# Altium project Ground_plate.PrjPcb
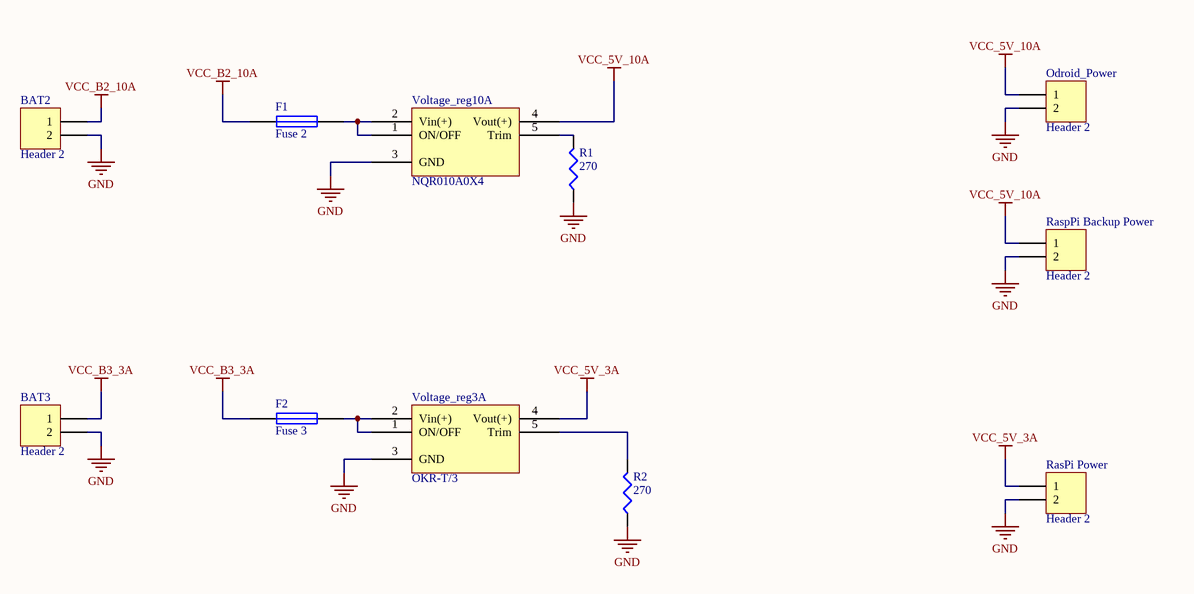
[diagram p0: DCDC_converters.SchDoc]
4 sheets, 41 parts. Net scope: global (net labels, ports and power ports of the same name join across sheets).
Board file: Ground_plate.PcbDoc
Sheets:
  DCDC_converters.SchDoc
  IMU_level_shifter.SchDoc
  Motor_driver.SchDoc
  wheelmotor_connections.SchDoc

## Sheet DCDC_converters.SchDoc
size A4; Organization: EPFL; DocumentNumber: 1; Revision: 1; SheetNumber: 1; SheetTotal: 1

### Parts
BAT2  Header 2  [STL1550/2-3.5]
BAT3  Header 2  [STL1550/2-3.5]
F1  Fuse 2  [FUSE_22.5MM]
F2  Fuse 3  [FUSE_22.5MM]
Odroid_Power  Header 2  [STL1550/2-3.5]
R1  270  [0805_G]
R2  270  [0805_G]
RasPi_Power  Header 2  [STL1550/2-3.5]
RaspPi_Backup_Power  Header 2  [STL1550/2-3.5]
Voltage_reg3A  OKR-T/3  [DC_Converter_3A]
Voltage_reg10A  NQR010A0X4  [DC_Converter_10A]

### Nets
GND: BAT2.2 BAT3.2 Odroid_Power.2 R1.1 R2.1 RasPi_Power.2 RaspPi_Backup_Power.2 Voltage_reg3A.3(GND) Voltage_reg10A.3(GND)
VCC_5V_3A: RasPi_Power.1 Voltage_reg3A.4(Vout(+))
VCC_5V_10A: Odroid_Power.1 RaspPi_Backup_Power.1 Voltage_reg10A.4(Vout(+))
VCC_B2_10A: BAT2.1 F1.1
VCC_B3_3A: BAT3.1 F2.1
NetF1_2: F1.2 Voltage_reg10A.1(ON/OFF) Voltage_reg10A.2(Vin(+))
NetF2_2: F2.2 Voltage_reg3A.1(ON/OFF) Voltage_reg3A.2(Vin(+))
NetR1_2: R1.2 Voltage_reg10A.5(Trim)
NetR2_2: R2.2 Voltage_reg3A.5(Trim)

### Notes on the sheet
- Title
- Size:
- Date:
- A4
- Number:
- Time:
- Revision:
- Sheet
- of
- File:

### Library data of the parts
BAT2 BAT3 Odroid_Power RasPi_Power RaspPi_Backup_Power = Header 2: Header, 2-Pin; LatestRevisionDate: 17-Jul-2002; LatestRevisionNote: Re-released for DXP Platform.; Publisher: Altium Limited
F1 F2 = Fuse 1: Fuse; Published: 8-Jun-2000; LatestRevisionDate: 17-Jul-2002; LatestRevisionNote: Re-released for DXP Platform.; PackageReference: PIN-W2/E2.8; Publisher: Altium Limited; PackageDescription: Thru-Hole; 2 Leads
R1 R2 = Res3: Resistor; Value: 1K; Published: 8-Jun-2000; LatestRevisionDate: 29-May-2009; LatestRevisionNote: IPC-7351 Footprint Added.; PackageReference: J1-0603; Publisher: Altium Limited; PackageDescription: Chip Resistor
Voltage_reg3A = OKR-T/3: DCDC Converter 3Amps
Voltage_reg10A = NQR010A0X4: DCDC Converter 10Amps; Mfr: LINEAGE POWER

## Sheet IMU_level_shifter.SchDoc
size A4; PageSetup: Record=PageOptions|CenterHorizontal=True|CenterVertical=True|PrintScale=0.71|XCorrection=1.00|YCorrection=1.00|PrintKind=1|BorderSize=5000000|LeftOffset=0|BottomOffset=0|Orientation=2|PaperLength=1000|PaperWidth=1000|Scale=100|PaperSource=7|PrintQuality=-4|MediaType=1|DitherType=10|PaperKind=A3 (297 x 420 mm)|PrintScaleMode=1; Organization: EPFL; DocumentNumber: 1; Revision: 1; SheetNumber: 1; SheetTotal: 1
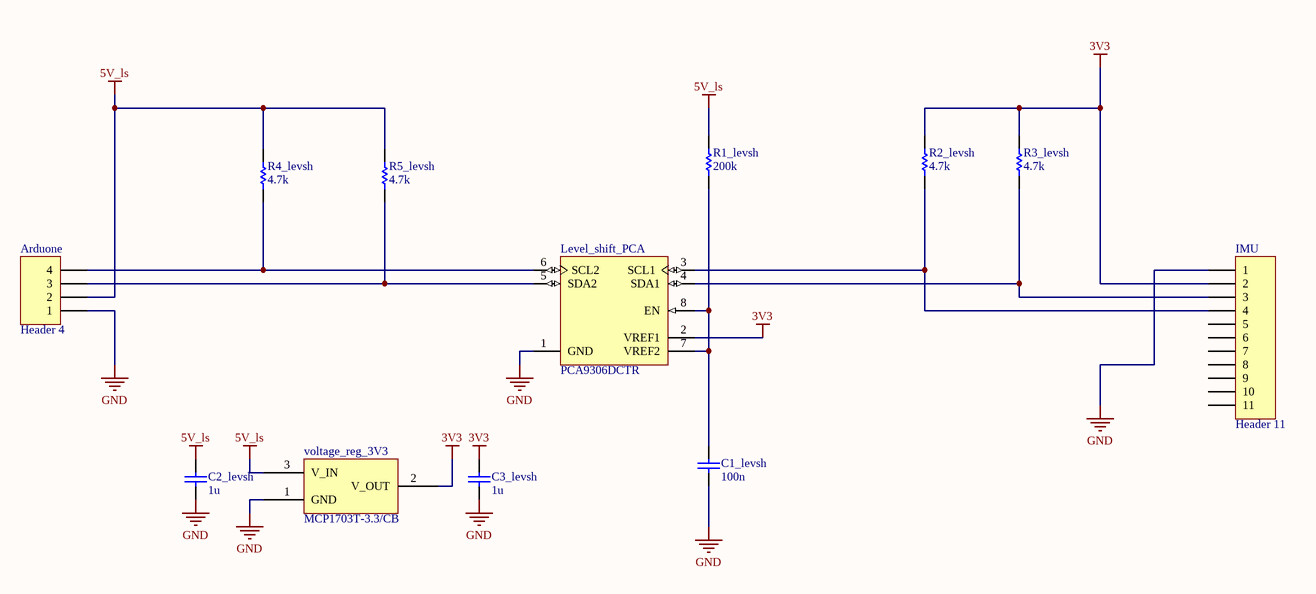
[diagram p1: IMU_level_shifter.SchDoc]

### Parts
Arduone  Header 4  [HDR1X4]
C1_levsh  100n  [CAPC1608N]
C2_levsh  1u  [CAPC1608N]
C3_levsh  1u  [CAPC1608N]
IMU  Header 11  [HDR1X11]
Level_shift_PCA  PCA9306DCTR  [DCT8_N]
R1_levsh  200k  [RESC1608N]
R2_levsh  4.7k  [RESC1608N]
R3_levsh  4.7k  [RESC1608N]
R4_levsh  4.7k  [RESC1608N]
R5_levsh  4.7k  [RESC1608N]
voltage_reg_3V3  MCP1703T-3.3/CB  [SOT23-3N]

### Nets
3V3: C3_levsh.2 IMU.2 Level_shift_PCA.2(VREF1) R2_levsh.2 R3_levsh.2 voltage_reg_3V3.2(V_OUT)
5V_ls: Arduone.2 C2_levsh.2 R1_levsh.1 R4_levsh.2 R5_levsh.2 voltage_reg_3V3.3(V_IN)
GND: Arduone.1 C1_levsh.1 C2_levsh.1 C3_levsh.1 IMU.1 Level_shift_PCA.1(GND) voltage_reg_3V3.1(GND)
NetArduone_3: Arduone.3 Level_shift_PCA.5(SDA2) R5_levsh.1
NetArduone_4: Arduone.4 Level_shift_PCA.6(SCL2) R4_levsh.1
NetC1_levsh_2: C1_levsh.2 Level_shift_PCA.7(VREF2) Level_shift_PCA.8(EN) R1_levsh.2
NetIMU_3: IMU.3 Level_shift_PCA.4(SDA1) R3_levsh.1
NetIMU_4: IMU.4 Level_shift_PCA.3(SCL1) R2_levsh.1

Not connected (* = marked no-connect by the designer): IMU 5 6 7 8 9 10 11

### Notes on the sheet
- Title
- Size:
- Date:
- A4
- Number:
- Time:
- Revision:
- Sheet
- of
- File:

### Library data of the parts
Arduone = Header 4: Header, 4-Pin; LatestRevisionDate: 17-Jul-2002; LatestRevisionNote: Re-released for DXP Platform.; Publisher: Altium Limited
C1_levsh C2_levsh C3_levsh = Cap: Capacitor; Published: 8-Jun-2000; LatestRevisionDate: 17-Jul-2002; LatestRevisionNote: Re-released for DXP Platform.; PackageReference: RAD-0.3; Publisher: Altium Limited; PackageDescription: Radial Cap, Thru-Hole; 2 Leads; 0.3 in Pin Spacing
IMU = Header 11: Header, 11-Pin; LatestRevisionDate: 17-Jul-2002; LatestRevisionNote: Re-released for DXP Platform.; Publisher: Altium Limited
Level_shift_PCA = PCA9306DCTR: Dual Bi-Directional I2C-Bus and SMBus Voltage Level-Translator, 0 to 5.5 V, -40 to 85 degC, 8-pin SM8 (DCT), Green (RoHS & no Sb/Br); Manufacturer: Texas Instruments; SubFamily: I2C Special Function; No. of Outputs: 2; tpd max(ns): 1.5; fSCLK(Max)(MHz): 400; Function: Voltage Translator; Vcc range(V): 0 to 5.5; Enable Pin: Yes; Rating: Catalog; DatasheetVersion: SCPS113J; PackageVersion: revC, Sep-2002; PackageReference: DCT8; PackageDescription: 8-Pin Thin Small Outline Package 3 x 2.8 mm Body ,0.65 mm Pitch; Supplier 1: Digi-Key; Supplier Part Number 1: 296-18509-2-ND; Supplier 2: Digi-Key; Supplier Part Number 2: 296-18509-1-ND; Supplier 3: Digi-Key; Supplier Part Number 3: 296-18509-6-ND; Supplier 4: Farnell; Supplier Part Number 4: 1470936RL; Supplier 5: Farnell; Supplier Part Number 5: 1470936; Supplier 6: Newark; Supplier Part Number 6: 65J6232; Supplier 7: Mouser; Supplier Part Number 7: 595-PCA9306DCTR; Eco-Plan: Green (RoHS & no Sb/Br); Max Frequency(kHz): 400; Open Drain I/O Type: Yes; 5V Tolerant I/O: Yes; On-Chip Power-on-Reset: No; Mounting Technology: Surface Mount; PartNumber: PCA9306DCTR; Code_JEDEC: MO-187-DA; ComponentLink1Description: Datasheet; ComponentLink1URL: http://www.ti.com/general/docs/lit/getliterature.tsp?genericPartNumber=PCA9306&fileType=pdf; ComponentLink2Description: Package Specification; ComponentLink2URL: http://www.ti.com/litv/pdf/mpds049b
R1_levsh R2_levsh R3_levsh R4_levsh R5_levsh = Res1: Resistor; Published: 8-Jun-2000; LatestRevisionDate: 17-Jul-2002; LatestRevisionNote: Re-released for DXP Platform.; PackageReference: AXIAL-0.3; Publisher: Altium Limited; PackageDescription: Axial Device, Thru-Hole; 2 Leads; 0.3 in Pin Spacing
voltage_reg_3V3 = MCP1703T/CB: 250 mA, 16V, Low Quiescent Current LDO Regulator

## Sheet Motor_driver.SchDoc
size A4; Organization: EPFL; DocumentNumber: 1; Revision: 1; SheetNumber: 1; SheetTotal: 1
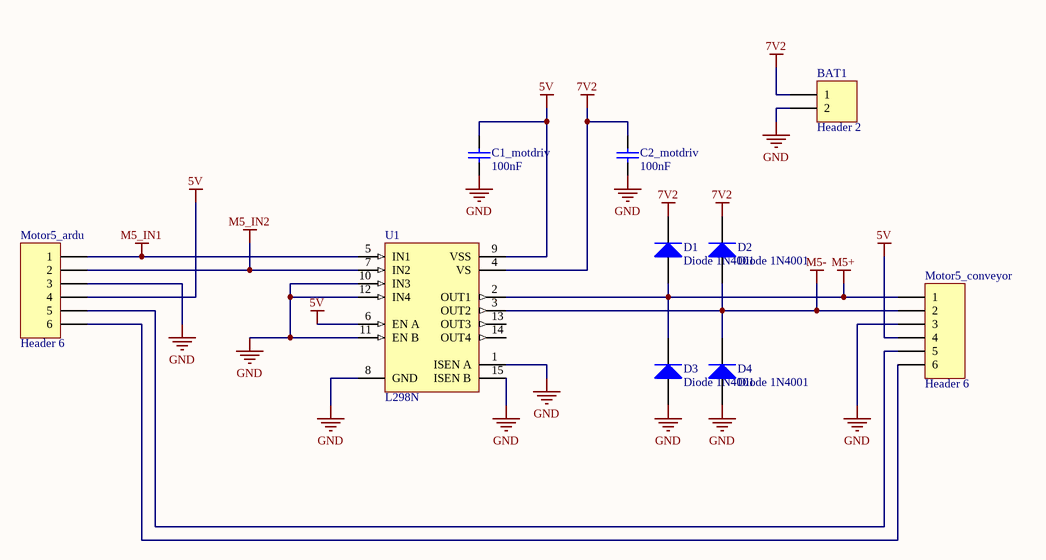
[diagram p2: Motor_driver.SchDoc]

### Parts
BAT1  Header 2  [STL1550/2-3.5]
C1_motdriv  100nF  [CAPC1608N]
C2_motdriv  100nF  [CAPC1608N]
D1  Diode 1N4001  [DO-41]
D2  Diode 1N4001  [DO-41]
D3  Diode 1N4001  [DO-41]
D4  Diode 1N4001  [DO-41]
Motor5_ardu  Header 6  [HDR1X6]
Motor5_conveyor  Header 6  [HDR1X6]
U1  L298N  [MULTIWAT15]

### Nets
5V: C1_motdriv.2 Motor5_ardu.4 Motor5_conveyor.4 U1.6(EN_A) U1.9(VSS)
7V2: BAT1.1 C2_motdriv.2 D1.2(K) D2.2(K) U1.4(VS)
GND: BAT1.2 C1_motdriv.1 C2_motdriv.1 D3.1(A) D4.1(A) Motor5_ardu.3 Motor5_conveyor.3 U1.1(ISEN_A) U1.8(GND) U1.10(IN3) U1.11(EN_B) U1.12(IN4) U1.15(ISEN_B)
M5+: D1.1(A) D3.2(K) Motor5_conveyor.1 U1.2(OUT1)
M5-: D2.1(A) D4.2(K) Motor5_conveyor.2 U1.3(OUT2)
M5_IN1: Motor5_ardu.1 U1.5(IN1)
M5_IN2: Motor5_ardu.2 U1.7(IN2)
NetMotor5_ardu_5: Motor5_ardu.5 Motor5_conveyor.5
NetMotor5_ardu_6: Motor5_ardu.6 Motor5_conveyor.6

Not connected (* = marked no-connect by the designer): U1 13(OUT3) 14(OUT4)

### Notes on the sheet
- Title
- Size:
- Date:
- A4
- Number:
- Time:
- Revision:
- Sheet
- of
- File:

### Library data of the parts
BAT1 = Header 2: Header, 2-Pin; LatestRevisionDate: 17-Jul-2002; LatestRevisionNote: Re-released for DXP Platform.; Publisher: Altium Limited
C1_motdriv C2_motdriv = Cap: Capacitor; Published: 8-Jun-2000; LatestRevisionDate: 17-Jul-2002; LatestRevisionNote: Re-released for DXP Platform.; PackageReference: RAD-0.3; Publisher: Altium Limited; PackageDescription: Radial Cap, Thru-Hole; 2 Leads; 0.3 in Pin Spacing
D1-D4 = Diode 1N4001: 1 Amp General Purpose Rectifier; Published: 8-Jun-2000; LatestRevisionDate: 17-Jul-2002; LatestRevisionNote: Re-released for DXP Platform.; DatasheetVersion: 1998; PackageVersion: Aug-1999; PackageReference: DO-41; Publisher: Altium Limited; PackageDescription: Diode, Axial; Body 5.2 x 2.7 mm (LxDia. max), Lead Dia. 0.86 mm (max); Code_JEDEC: DO-204-AL; ComponentLink1Description: Manufacturer Link; ComponentLink1URL: http://www.fairchildsemi.com/; ComponentLink2Description: Datasheet; ComponentLink2URL: http://www.fairchildsemi.com/ds/1N%2F1N4001.pdf
Motor5_ardu Motor5_conveyor = Header 6: Header, 6-Pin; LatestRevisionDate: 17-Jul-2002; LatestRevisionNote: Re-released for DXP Platform.; Publisher: Altium Limited
U1 = L298N: Dual Full Bridge Driver; Published: 8-Jun-2000; LatestRevisionDate: 14-May-2007; LatestRevisionNote: Mapped to vertical PCB.; DatasheetVersion: Jul-1999; PackageReference: Multiwatt15V; Publisher: Altium Limited; PackageDescription: TO, Thru-Hole, Vertical, Heatsink Mounted; 15 Bent Staggered Leads; Pitch 1.27 mm; ComponentLink1Description: Manufacturer Link; ComponentLink1URL: http://www.st.com/; ComponentLink2Description: Datasheet; ComponentLink2URL: http://www.st.com/stonline/products/literature/ds/1773/l298.pdf

## Sheet wheelmotor_connections.SchDoc
size A4
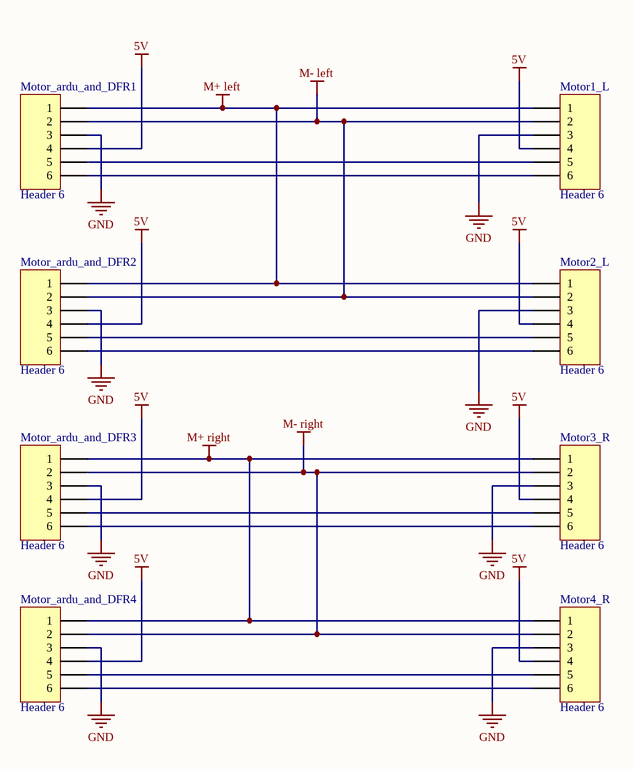
[diagram p3: wheelmotor_connections.SchDoc]

### Parts
Motor1_L  Header 6  [HDR1X6]
Motor2_L  Header 6  [HDR1X6]
Motor3_R  Header 6  [HDR1X6]
Motor4_R  Header 6  [HDR1X6]
Motor_ardu_and_DFR1  Header 6  [HDR1X6]
Motor_ardu_and_DFR2  Header 6  [HDR1X6]
Motor_ardu_and_DFR3  Header 6  [HDR1X6]
Motor_ardu_and_DFR4  Header 6  [HDR1X6]

### Nets
5V: Motor1_L.4 Motor2_L.4 Motor3_R.4 Motor4_R.4 Motor_ardu_and_DFR1.4 Motor_ardu_and_DFR2.4 Motor_ardu_and_DFR3.4 Motor_ardu_and_DFR4.4
GND: Motor1_L.3 Motor2_L.3 Motor3_R.3 Motor4_R.3 Motor_ardu_and_DFR1.3 Motor_ardu_and_DFR2.3 Motor_ardu_and_DFR3.3 Motor_ardu_and_DFR4.3
M+ left: Motor1_L.1 Motor2_L.1 Motor_ardu_and_DFR1.1 Motor_ardu_and_DFR2.1
M+ right: Motor3_R.1 Motor4_R.1 Motor_ardu_and_DFR3.1 Motor_ardu_and_DFR4.1
M- left: Motor1_L.2 Motor2_L.2 Motor_ardu_and_DFR1.2 Motor_ardu_and_DFR2.2
M- right: Motor3_R.2 Motor4_R.2 Motor_ardu_and_DFR3.2 Motor_ardu_and_DFR4.2
NetMotor1_L_5: Motor1_L.5 Motor_ardu_and_DFR1.5
NetMotor1_L_6: Motor1_L.6 Motor_ardu_and_DFR1.6
NetMotor2_L_5: Motor2_L.5 Motor_ardu_and_DFR2.5
NetMotor2_L_6: Motor2_L.6 Motor_ardu_and_DFR2.6
NetMotor3_R_5: Motor3_R.5 Motor_ardu_and_DFR3.5
NetMotor3_R_6: Motor3_R.6 Motor_ardu_and_DFR3.6
NetMotor4_R_5: Motor4_R.5 Motor_ardu_and_DFR4.5
NetMotor4_R_6: Motor4_R.6 Motor_ardu_and_DFR4.6

### Notes on the sheet
- Title
- Size:
- Date:
- A4
- Number:
- Time:
- Revision:
- Sheet
- of
- File:

### Library data of the parts
Motor1_L Motor2_L Motor3_R Motor4_R Motor_ardu_and_DFR1-Motor_ardu_and_DFR4 = Header 6: Header, 6-Pin; LatestRevisionDate: 17-Jul-2002; LatestRevisionNote: Re-released for DXP Platform.; Publisher: Altium Limited

## Nets that join several sheets
5V: Motor_driver (5 pins), wheelmotor_connections (8 pins)
GND: DCDC_converters (9 pins), IMU_level_shifter (7 pins), Motor_driver (13 pins), wheelmotor_connections (8 pins)